# EAGLE schematic PoE_mag (EAGLE 6.4)

## Sheet 1 of 3
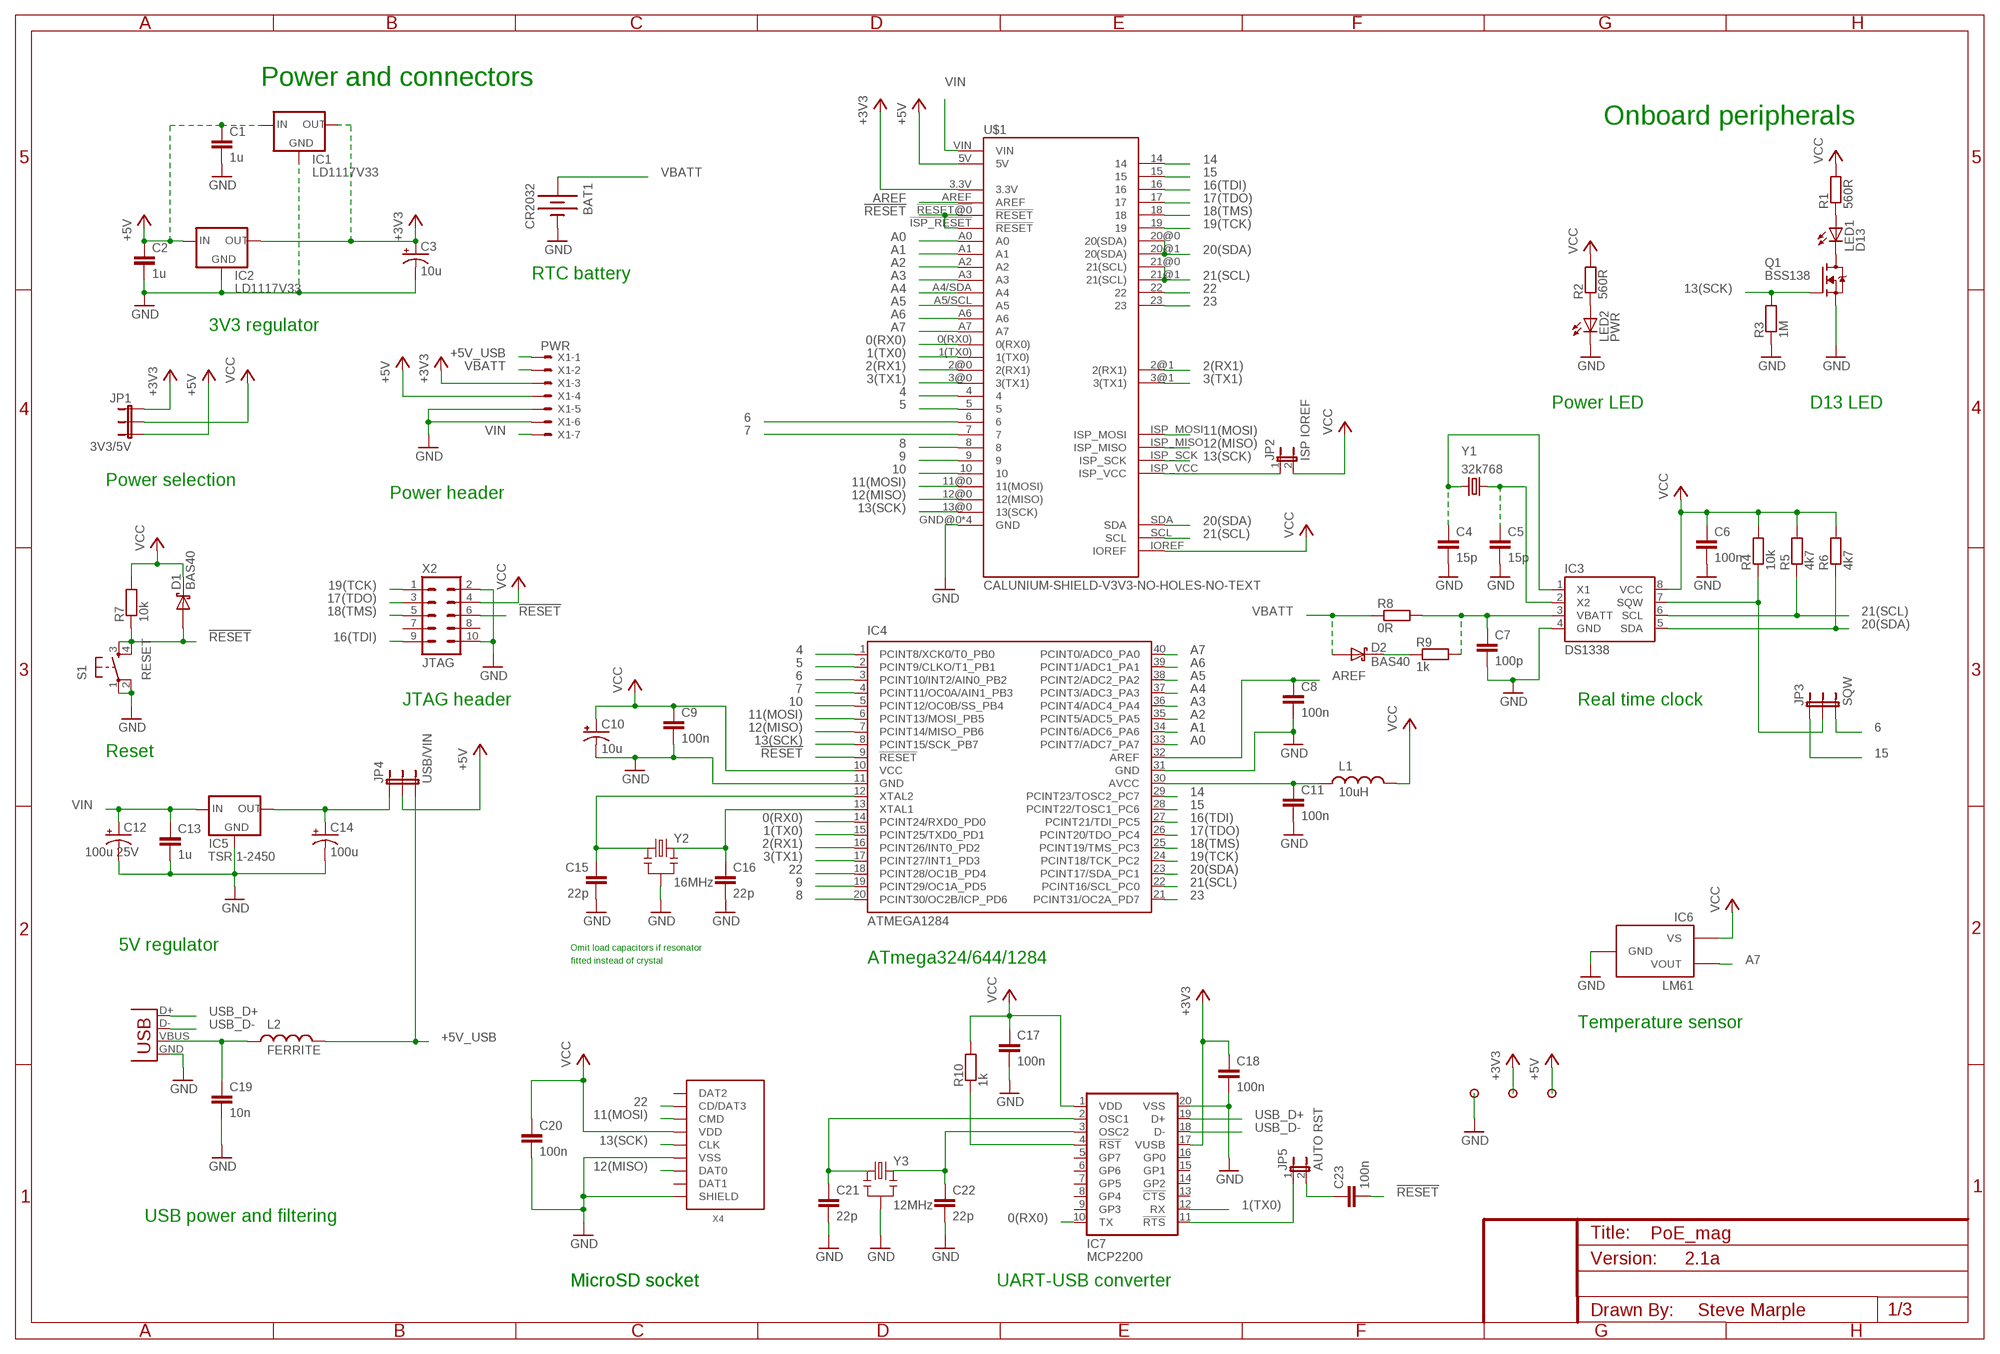
[diagram p0: schematic, sheet 1]

### Parts
BAT1  CR2032  BATTERY20PTH  [BATTCOM_20MM_PTH]
C1  1u  C-EU1206-HAND  [1206-HAND]
C2  1u  C-EU1206-HAND  [1206-HAND]
C3  10u  CAP_POLPTH2  [CPOL-RADIAL-10UF-25V]
C4  15p  C-EU0805-HAND  [0805-HAND]
C5  15p  C-EU0805-HAND  [0805-HAND]
C6  100n  C-EU1206-HAND  [1206-HAND]
C7  100p  C-EU1206-HAND  [1206-HAND]
C8  100n  C-EU1206-HAND  [1206-HAND]
C9  100n  C-EU1206-HAND  [1206-HAND]
C10  10u  CAP_POLPTH2  [CPOL-RADIAL-10UF-25V]
C11  100n  C-EU1206-HAND  [1206-HAND]
C12  100u 25V  CAP_POL  [CPOL-RADIAL-100UF-25V-150MIL]
C13  1u  C-EU1206-HAND  [1206-HAND]
C14  100u  CAP_POL100UF-16V-100MIL  [CPOL-RADIAL-100UF-16V]
C15  22p  C-EU0805-HAND  [0805-HAND]
C16  22p  C-EU0805-HAND  [0805-HAND]
C17  100n  C-EU1206-HAND  [1206-HAND]
C18  100n  C-EU1206-HAND  [1206-HAND]
C19  10n  C-EU1206-HAND  [1206-HAND]
C20  100n  C-EU1206-HAND  [1206-HAND]
C21  22p  C-EU0805-HAND  [0805-HAND]
C22  22p  C-EU0805-HAND  [0805-HAND]
C23  100n  C-EU1206-HAND  [1206-HAND]
D1  BAS40  DIODE-SCHOTTKYSOT23-1-3-HAND  [SOT23-3-HAND]
D2  BAS40  DIODE-SCHOTTKYSOT23-1-3-HAND  [SOT23-3-HAND]
IC1  LD1117V33  V_REG_LD1117VXXSOT223-HAND  [SOT223-HAND]
IC2  LD1117V33  V_REG_LD1117VXXTO220  [TO220]
IC3  DS1338  DS1307SO08  [SO08]
IC4  ATMEGA1284  ATMEGA644-20PU  [DIL40]
IC5  TSR 1-2450  V_REG_78XXTSR/POWERPAX  [TSR-1-XXXX/POWERPAX-P78XX-10]
IC6  LM61  LM61SOT23  [SOT23-3-HAND]
IC7  MCP2200  [SO20]
JP1  3V3/5V  JUMPER-3PTH  [1X03]
JP2  ISP IOREF  JUMPER-2PTH  [1X02]
JP3  SQW  JUMPER-3PTH  [1X03]
JP4  USB/VIN  JUMPER-3PTH  [1X03]
JP5  AUTO RST  JUMPER-2PTH  [1X02]
L1  10uH  INDUCTOR1210-HAND  [1210-HAND]
L2  FERRITE  INDUCTOR0805-HAND  [0805-HAND]
LED1  D13  LED3MM  [LED3MM]
LED2  PWR  LED3MM  [LED3MM]
Q1  BSS138  BSS138SOT23-3-HAND  [SOT23-3-HAND]
R1  560R  RESISTOR1206-HAND  [1206-HAND]
R2  560R  RESISTOR1206-HAND  [1206-HAND]
R3  1M  RESISTOR1206-HAND  [1206-HAND]
R4  10k  RESISTOR1206-HAND  [1206-HAND]
R5  4k7  RESISTOR1206-HAND  [1206-HAND]
R6  4k7  RESISTOR1206-HAND  [1206-HAND]
R7  10k  RESISTOR1206-HAND  [1206-HAND]
R8  0R  RESISTOR1206-HAND  [1206-HAND]
R9  1k  RESISTOR1206-HAND  [1206-HAND]
R10  1k  RESISTOR1206-HAND  [1206-HAND]
S1  RESET  TAC_SWITCHPTH  [TACTILE-PTH]
U$1  CALUNIUM-SHIELD-V3V3-NO-HOLES-NO-TEXT  [CALUNIUM-SHIELD-NO-OUTLINE-NO-HOLES-NO-TEXT-V3]
U$2  PAD  [PAD]
U$3  PAD  [PAD]
U$4  PAD  [PAD]
X1  PWR  22-23-2071  [22-23-2071]
X2  JTAG  ATMEL-JTAG  [CON-HARTING-ML10]
X3  USB  USBPTH-VERTICAL  [USB-B-PTH-VERTICAL]
X4  MICRO-SD-SOCKETHIROSE-DM3D  [MICRO-SD-SOCKET-HIROSE-DM3D]
Y1  32k768  CRYSTALTC38H  [TC38H]
Y2  16MHz  CRYSTAL-RESONATOR  [HC49U-V-RESONATOR]
Y3  12MHz  CRYSTAL-RESONATOR  [HC49U-V-RESONATOR]

### Nets
0(RX0): IC4.14(PCINT24/RXD0_PD0) IC7.10(TX) U$1.0(RX0)
1(TX0): IC4.15(PCINT25/TXD0_PD1) IC7.12(RX) U$1.1(TX0)
2(RX1): IC4.16(PCINT26/INT0_PD2) U$1.2@0(2(RX1)) U$1.2@1(2(RX1)) ; also sheet 2
3(TX1): IC4.17(PCINT27/INT1_PD3) U$1.3@0(3(TX1)) U$1.3@1(3(TX1)) ; also sheet 2
4: IC4.1(PCINT8/XCK0/T0_PB0) U$1.4
5: IC4.2(PCINT9/CLKO/T1_PB1) U$1.5
6: IC4.3(PCINT10/INT2/AIN0_PB2) JP3.3 U$1.6 ; also sheet 2
7: IC4.4(PCINT11/OC0A/AIN1_PB3) U$1.7 ; also sheet 2
8: IC4.20(PCINT30/OC2B/ICP_PD6) U$1.8 ; also sheet 3
9: IC4.19(PCINT29/OC1A_PD5) U$1.9
10: IC4.5(PCINT12/OC0B/SS_PB4) U$1.10
11(MOSI): IC4.6(PCINT13/MOSI_PB5) U$1.11@0(11(MOSI)) U$1.ISP_MOSI X4.CMD
12(MISO): IC4.7(PCINT14/MISO_PB6) U$1.12@0(12(MISO)) U$1.ISP_MISO X4.DAT0
13(SCK): IC4.8(PCINT15/SCK_PB7) Q1.1(G) R3.2 U$1.13@0(13(SCK)) U$1.ISP_SCK X4.CLK
14: IC4.29(PCINT23/TOSC2_PC7) U$1.14
15: IC4.28(PCINT22/TOSC1_PC6) JP3.1 U$1.15
16(TDI): IC4.27(PCINT21/TDI_PC5) U$1.16 X2.9(TDI)
17(TDO): IC4.26(PCINT20/TDO_PC4) U$1.17 X2.3(TDO)
18(TMS): IC4.25(PCINT19/TMS_PC3) U$1.18 X2.5(TMS)
19(TCK): IC4.24(PCINT18/TCK_PC2) U$1.19 X2.1(TCK)
20(SDA): IC3.5(SDA) IC4.23(PCINT17/SDA_PC1) R6.1 U$1.20@0(20(SDA)) U$1.20@1(20(SDA)) U$1.SDA ; also sheet 3
21(SCL): IC3.6(SCL) IC4.22(PCINT16/SCL_PC0) R5.1 U$1.21@0(21(SCL)) U$1.21@1(21(SCL)) U$1.SCL ; also sheet 3
22: IC4.18(PCINT28/OC1B_PD4) U$1.22 X4.CD/DAT3
23: IC4.21(PCINT31/OC2A_PD7) U$1.23
!MCP2200_RESET: IC7.4(!RST) R10.1
!RESET: C23.2 D1.1(A) IC4.9(!RESET) R7.1 S1.3 S1.4 U$1.!ISP_RESET(!RESET) U$1.!RESET@0(!RESET) X2.6(!SRST)
+3V3 [power]: C3.1(+) C18.1 IC1.2(OUT) IC1.4(OUT) IC2.2(OUT) IC7.17(VUSB) JP1.1 U$1.3.3V U$3.1 X1.3 ; also sheet 2,3
+5V [power]: C1.1 C2.1 IC1.3(IN) IC2.3(IN) JP1.3 JP4.2 U$1.5V U$4.1 X1.4 ; also sheet 2,3
+5V_USB [power]: JP4.3 L2.2 X1.1
A0: IC4.33(PCINT7/ADC7_PA7) U$1.A0 ; also sheet 2
A1: IC4.34(PCINT6/ADC6_PA6) U$1.A1
A2: IC4.35(PCINT5/ADC5_PA5) U$1.A2 ; also sheet 3
A3: IC4.36(PCINT4/ADC4_PA4) U$1.A3
A4: IC4.37(PCINT3/ADC3_PA3) U$1.A4/SDA(A4)
A5: IC4.38(PCINT2/ADC2_PA2) U$1.A5/SCL(A5)
A6: IC4.39(PCINT1/ADC1_PA1) U$1.A6
A7: IC4.40(PCINT0/ADC0_PA0) IC6.2(VOUT) U$1.A7
AREF: C8.1 IC4.32(AREF) U$1.AREF
AUTO_RESET: IC7.11(!RTS) JP5.1
AVCC [power]: C11.1 IC4.30(AVCC) L1.1
GND [power]: BAT1.2(-) C1.2 C2.2 C3.2(-) C4.2 C5.2 C6.2 C7.2 C8.2 C9.2 C10.2(-) C11.2 C12.2(-) C13.2 C14.2(-) C15.2 C16.2 C17.2 C18.2 C19.2 C20.2 C21.2 C22.2 IC1.1(GND) IC2.1(GND) IC3.4(GND) IC4.11(GND) IC4.31(GND) IC5.2@A(GND) IC5.2@B(GND) IC6.3(GND) IC7.20(VSS) LED2.K(C) Q1.2(S) R3.1 S1.1 S1.2 U$1.GND@0(GND) U$1.GND@1(GND) U$1.GND@2(GND) U$1.GND@3(GND) U$2.1 X1.5 X1.6 X2.2(GND) X2.10(GND) X3.GND X4.GND(VSS) X4.SHIELD@0(SHIELD) Y2.GND Y3.GND ; also sheet 2,3
N$1: C16.1 IC4.13(XTAL1) Y2.2
N$2: C15.1 IC4.12(XTAL2) Y2.1
N$3: LED1.A R1.1
N$4: LED1.K(C) Q1.3(D)
N$5: C4.1 IC3.1(X1) Y1.2
N$6 [power]: JP2.1 U$1.ISP_VCC
N$7: C22.1 IC7.3(OSC2) Y3.2
N$8: LED2.A R2.1
N$9: D2.3(C) R9.1
N$11: C7.1 IC3.3(VBATT) R8.2 R9.2
N$12: C5.1 IC3.2(X2) Y1.1
N$14 [power]: C14.1(+) IC5.3@A(OUT) IC5.3@B(OUT) JP4.1
N$15: C23.1 JP5.2
N$18: C21.1 IC7.2(OSC1) Y3.1
SQW: IC3.7(SQW) JP3.2 R4.1
USB_D+: IC7.19(D+) X3.D+
USB_D-: IC7.18(D-) X3.D-
VBATT: BAT1.1(+) D2.1(A) R8.1 X1.2 ; also sheet 2
VBUS [power]: C19.1 L2.1 X3.VBUS
VCC [power]: C6.1 C9.1 C10.1(+) C17.1 C20.1 D1.3(C) IC3.8(VCC) IC4.10(VCC) IC6.1(VS) IC7.1(VDD) JP1.2 JP2.2 L1.2 R1.2 R2.2 R4.2 R5.2 R6.2 R7.2 R10.2 U$1.IOREF X2.4(VTREF) X4.VDD ; also sheet 2,3
VIN [power]: C12.1(+) C13.1 IC5.1@A(IN) IC5.1@B(IN) U$1.VIN X1.7 ; also sheet 3
Unconnected: IC7.5(GP7) IC7.6(GP6) IC7.7(GP5) IC7.8(GP4) IC7.9(GP3) IC7.13(!CTS) IC7.14(GP2) IC7.15(GP1) IC7.16(GP0) X2.7(NC) X2.8(NC) X4.DAT1 X4.DAT2

### Notes on the sheet
- Power and connectors
- Onboard peripherals
- RTC battery
- 3V3 regulator
- Power LED | D13 LED
- Power selection
- Power header
- JTAG header | Real time clock
- Reset
- 5V regulator | Omit load capacitors if resonator
- fitted instead of crystal | ATmega324/644/1284
- Temperature sensor
- USB power and filtering
- 2.1a
- MicroSD socket | MicroSD socket | UART-USB converter
- Steve Marple

## Sheet 2 of 3
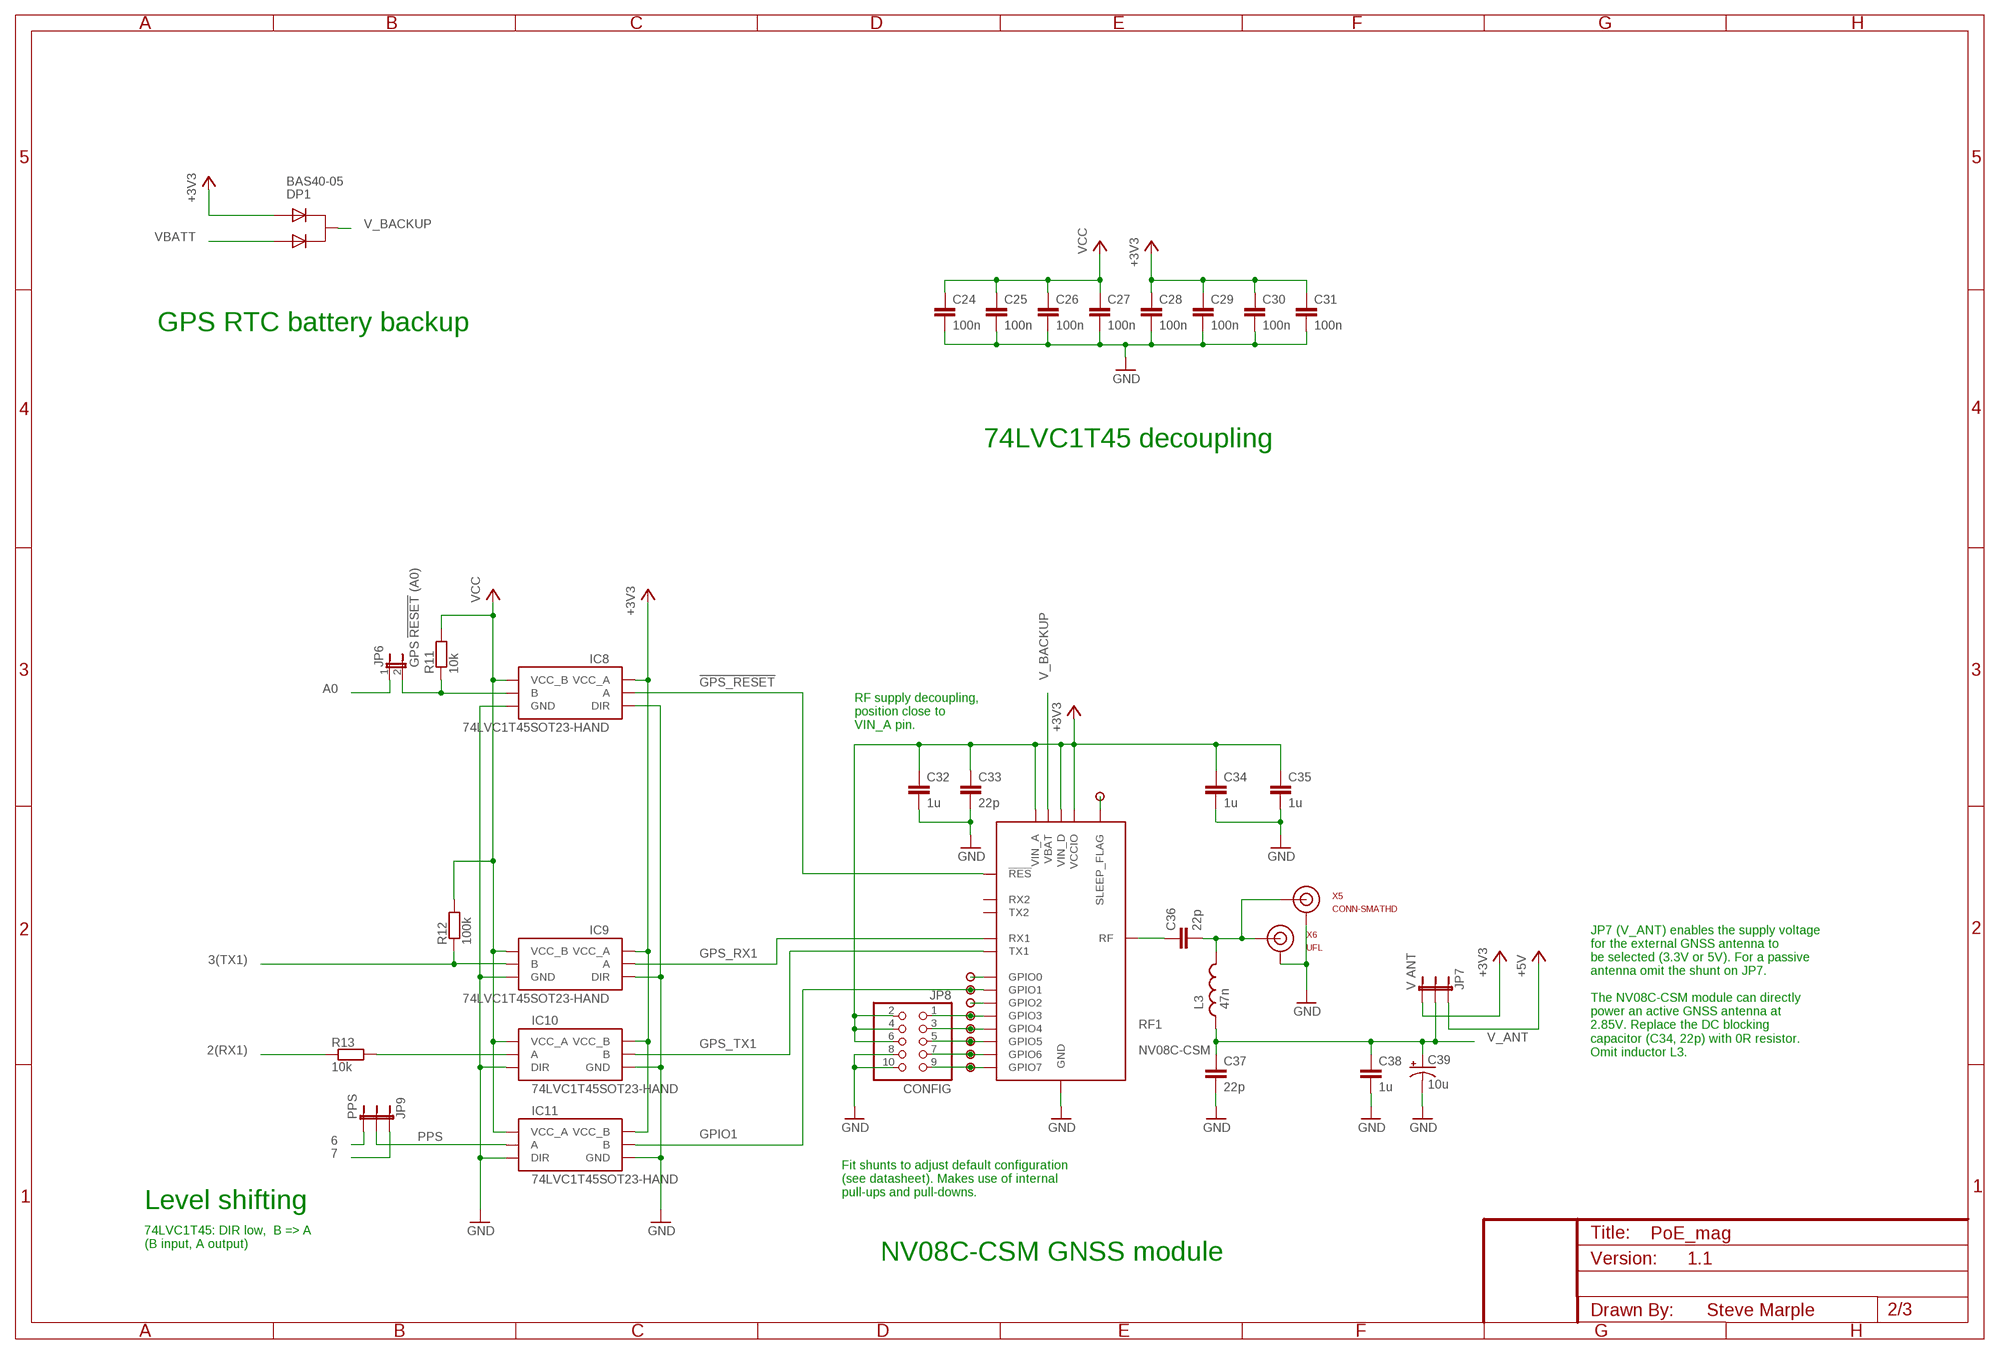
[diagram p1: schematic, sheet 2]

### Parts
C24  100n  C-EU1206-HAND  [1206-HAND]
C25  100n  C-EU1206-HAND  [1206-HAND]
C26  100n  C-EU1206-HAND  [1206-HAND]
C27  100n  C-EU1206-HAND  [1206-HAND]
C28  100n  C-EU1206-HAND  [1206-HAND]
C29  100n  C-EU1206-HAND  [1206-HAND]
C30  100n  C-EU1206-HAND  [1206-HAND]
C31  100n  C-EU1206-HAND  [1206-HAND]
C32  1u  C-EU1206-HAND  [1206-HAND]
C33  22p  C-EU0805-HAND  [0805-HAND]
C34  1u  C-EU1206-HAND  [1206-HAND]
C35  1u  C-EU1206-HAND  [1206-HAND]
C36  22p  C-EU0805-HAND  [0805-HAND]
C37  22p  C-EU0805-HAND  [0805-HAND]
C38  1u  C-EU1206-HAND  [1206-HAND]
C39  10u  CAP_POLPTH2  [CPOL-RADIAL-10UF-25V]
DP1  BAS40-05  DIODE-PAIR-COMMON-CATHODE  [SOT23-3-HAND]
IC8  74LVC1T45SOT23-HAND  [SOT23-6-HAND]
IC9  74LVC1T45SOT23-HAND  [SOT23-6-HAND]
IC10  74LVC1T45SOT23-HAND  [SOT23-6-HAND]
IC11  74LVC1T45SOT23-HAND  [SOT23-6-HAND]
JP6  GPS !RESET! (A0)  JUMPER-2PTH  [1X02]
JP7  V ANT  JUMPER-3PTH  [1X03]
JP8  CONFIG  PINHD-2X5  [2X05]
JP9  PPS  JUMPER-3PTH  [1X03]
L3  47n  INDUCTOR0805-HAND  [0805-HAND]
R11  10k  RESISTOR1206-HAND  [1206-HAND]
R12  100k  RESISTOR1206-HAND  [1206-HAND]
R13  10k  RESISTOR1206-HAND  [1206-HAND]
RF1  NV08C-CSM  NV08C-CSMHAND  [NVC08C-CSM-HAND]
U$5  PAD  [PAD]
U$6  PAD  [PAD]
U$7  PAD  [PAD]
U$8  ?  PAD  [PAD]
U$9  PAD  [PAD]
U$10  PAD  [PAD]
U$11  PAD  [PAD]
U$12  PAD  [PAD]
U$13  PAD  [PAD]
X5  CONN-SMATHD  [SMA-THD]
X6  UFL  CONN-UFLHAND  [CONN-UFL-HAND-SOLDERING]

### Nets
2(RX1): R13.1 ; also sheet 1
3(TX1): IC9.4(B) R12.1 ; also sheet 1
6: JP9.3 ; also sheet 1
7: JP9.1 ; also sheet 1
!GPS_RESET: IC8.3(A) RF1.P$25(!RES)
+3V3 [power]: C28.1 C29.1 C30.1 C31.1 C32.1 C33.1 C34.1 C35.1 DP1.2(A2) IC8.1(VCC_A) IC9.1(VCC_A) IC10.6(VCC_B) IC11.6(VCC_B) JP7.3 JP8.2 JP8.4 JP8.6 RF1.P$8(VIN_A) RF1.P$26(VIN_D) RF1.P$28(VCCIO) ; also sheet 1,3
+5V [power]: JP7.1 ; also sheet 1,3
A0: JP6.1 ; also sheet 1
GND [power]: C24.2 C25.2 C26.2 C27.2 C28.2 C29.2 C30.2 C31.2 C32.2 C33.2 C34.2 C35.2 C37.2 C38.2 C39.2(-) IC8.2(GND) IC8.5(DIR) IC9.2(GND) IC9.5(DIR) IC10.2(GND) IC10.5(DIR) IC11.2(GND) IC11.5(DIR) JP8.8 JP8.10 RF1.P$3(GND) RF1.P$9(GND) RF1.P$10(GND) RF1.P$11(GND) RF1.P$12(GND) RF1.P$13(GND) RF1.P$14(GND) RF1.P$16(GND) RF1.P$17(GND) RF1.P$18(GND) RF1.P$19(GND) RF1.P$22(GND) RF1.P$24(GND) RF1.P$27(GND) RF1.P$29(GND) RF1.P$34(GND) X5.GND@0(GND) X5.GND@1(GND) X5.GND@2(GND) X5.GND@3(GND) X6.GND@0(GND) X6.GND@1(GND) ; also sheet 1,3
GPIO0: RF1.P$20(GPIO0) U$6.1
GPIO1: IC11.4(B) RF1.P$2(GPIO1) U$7.1
GPIO2: RF1.P$1(GPIO2) U$8.1
GPIO3: JP8.1 RF1.P$6(GPIO3) U$9.1
GPIO4: JP8.3 RF1.P$7(GPIO4) U$10.1
GPIO5: JP8.5 RF1.P$4(GPIO5) U$11.1
GPIO6: JP8.7 RF1.P$35(GPIO6) U$12.1
GPIO7: JP8.9 RF1.P$5(GPIO7) U$13.1
GPS_RX1: IC9.3(A) RF1.P$33(RX1)
GPS_TX1: IC10.4(B) RF1.P$32(TX1)
N$22: IC8.4(B) JP6.2 R11.1
N$23 [antenna]: C36.2 L3.2 X5.SIG(SIGNAL) X6.SIGNAL
N$24 [antenna]: C36.1 RF1.P$15(RF)
N$25: IC10.3(A) R13.2
PPS: IC11.3(A) JP9.2
SLEEP_FLAG: RF1.P$21(SLEEP_FLAG) U$5.1
V_ANT [power]: C37.1 C38.1 C39.1(+) JP7.2 L3.1
V_BACKUP: DP1.3(C) RF1.P$23(VBAT)
VBATT: DP1.1(A1) ; also sheet 1
VCC [power]: C24.1 C25.1 C26.1 C27.1 IC8.6(VCC_B) IC9.6(VCC_B) IC10.1(VCC_A) IC11.1(VCC_A) R11.2 R12.2 ; also sheet 1,3
Unconnected: RF1.P$30(RX2) RF1.P$31(TX2)

### Notes on the sheet
- GPS RTC battery backup
- 74LVC1T45 decoupling
- RF supply decoupling,
  position close to
  VIN_A pin.
- JP7 (V_ANT) enables the supply voltage
  for the external GNSS antenna to
  be selected (3.3V or 5V). For a passive
  antenna omit the shunt on JP7.
  
  The NV08C-CSM module can directly
  power an active GNSS antenna at
  2.85V. Replace the DC blocking
  capacitor (C34, 22p) with 0R resistor.
  Omit inductor L3.
- Fit shunts to adjust default configuration
  (see datasheet). Makes use of internal
  pull-ups and pull-downs.
- Level shifting
- 74LVC1T45: DIR low,  B => A
  (B input, A output)
- NV08C-CSM GNSS module | 1.1
- Steve Marple

## Sheet 3 of 3
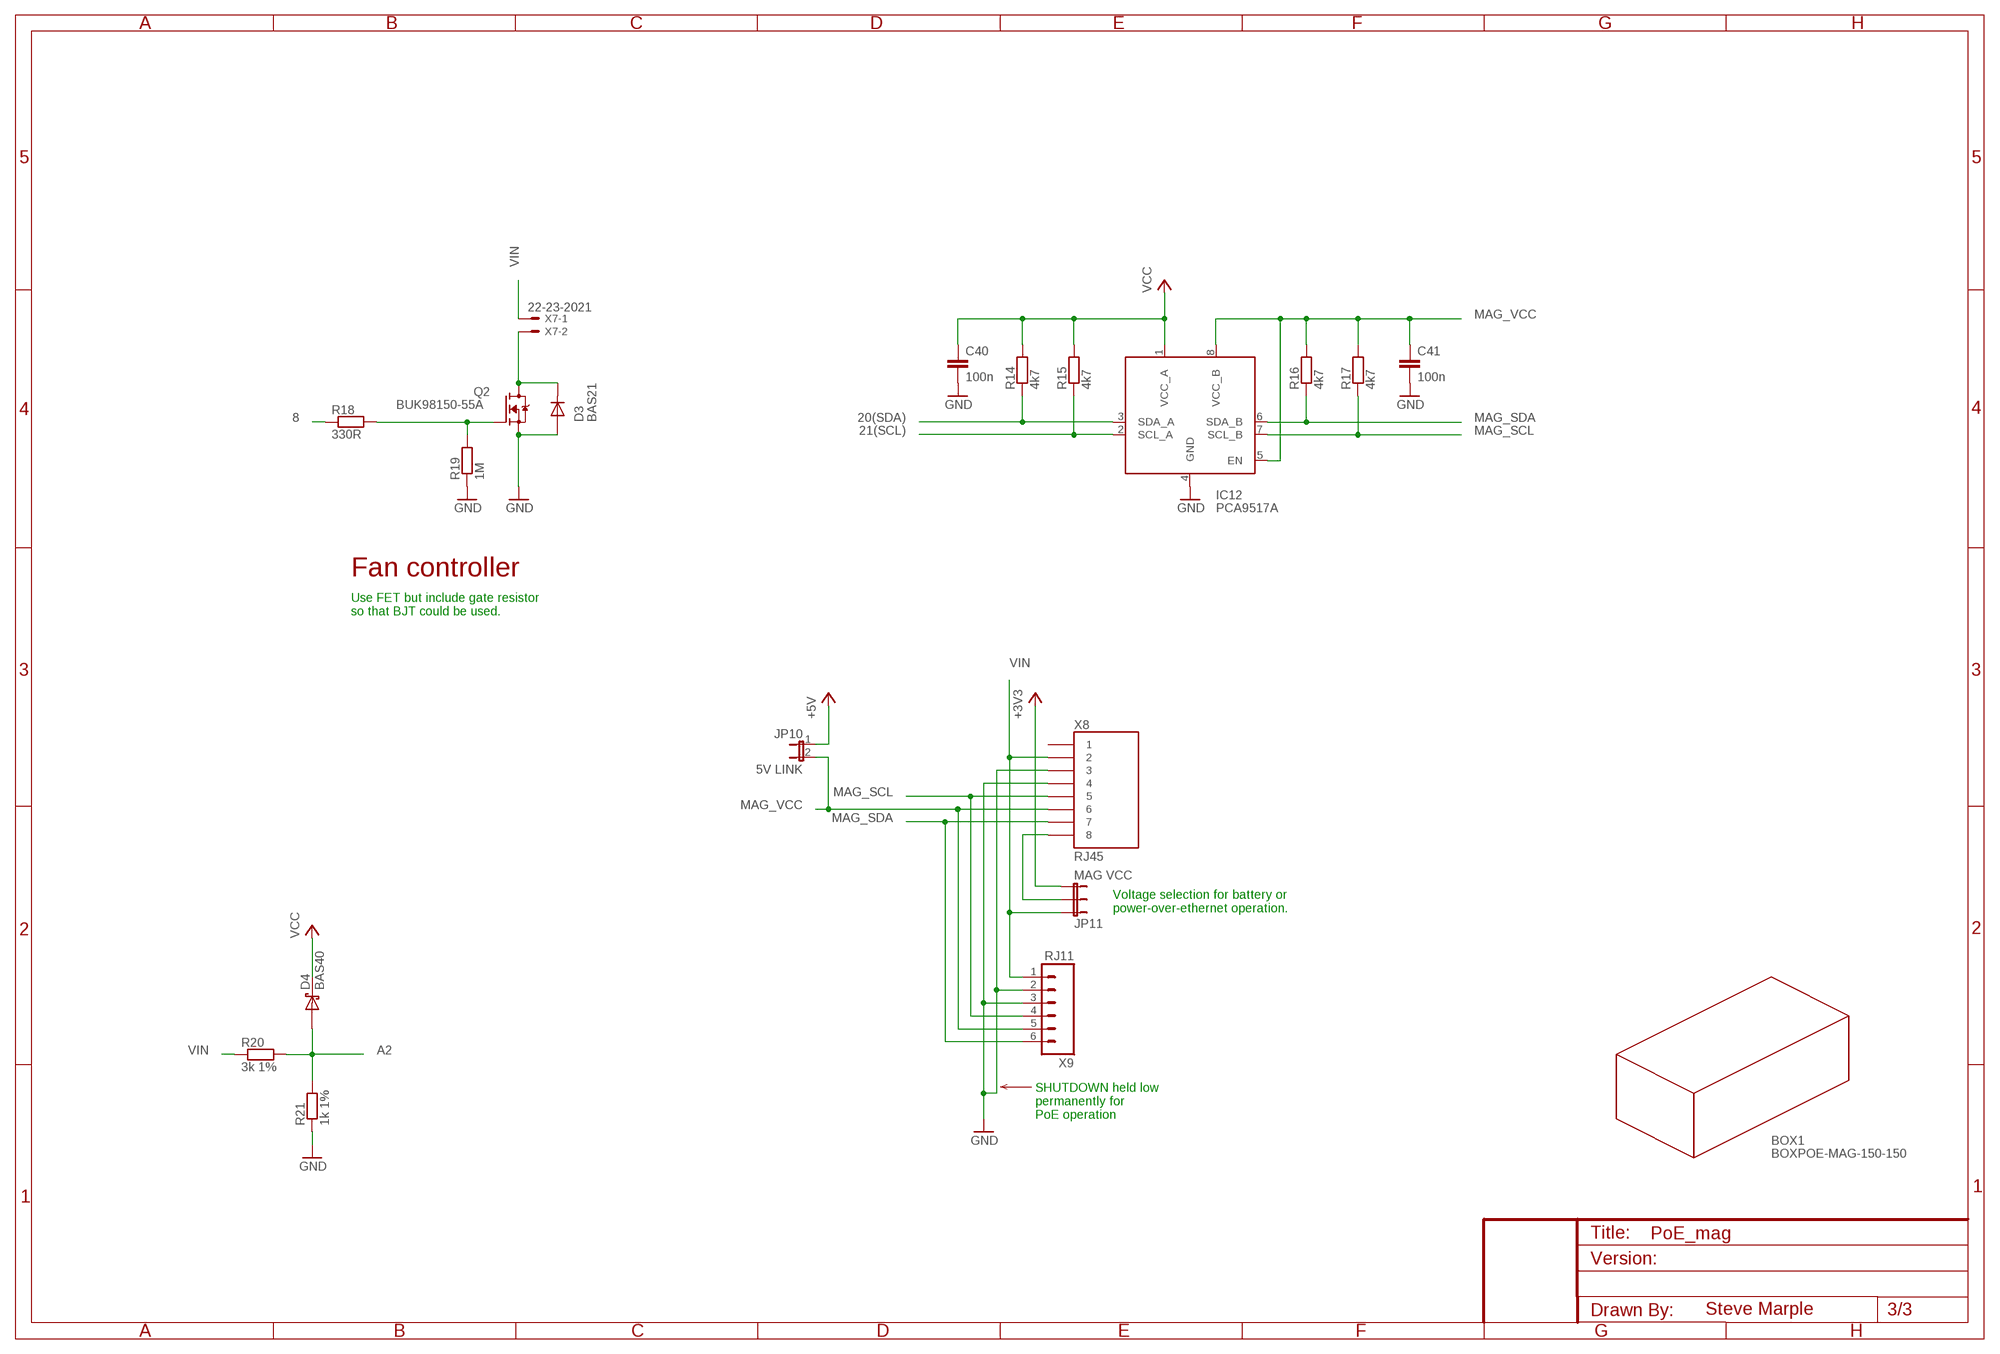
[diagram p2: schematic, sheet 3]

### Parts
BOX1  BOXPOE-MAG-150-150  [FIBOX-PC-M-95-G-POE-MAG]
C40  100n  C-EU1206-HAND  [1206-HAND]
C41  100n  C-EU1206-HAND  [1206-HAND]
D3  BAS21  DIODESOT23-1-3-HAND  [SOT23-3-HAND]
D4  BAS40  DIODE-SCHOTTKYSOT23-1-3-HAND  [SOT23-3-HAND]
IC12  PCA9517A  PCA9517ASOIC  [SO08]
JP10  5V LINK  JUMPER-2PTH  [1X02]
JP11  MAG VCC  JUMPER-3PTH  [1X03]
Q2  BUK98150-55A  FET-N-TYPESOT223-HAND  [SOT223-HAND]
R14  4k7  RESISTOR1206-HAND  [1206-HAND]
R15  4k7  RESISTOR1206-HAND  [1206-HAND]
R16  4k7  RESISTOR1206-HAND  [1206-HAND]
R17  4k7  RESISTOR1206-HAND  [1206-HAND]
R18  330R  RESISTOR1206-HAND  [1206-HAND]
R19  1M  RESISTOR1206-HAND  [1206-HAND]
R20  3k 1%  RESISTOR1206-HAND  [1206-HAND]
R21  1k 1%  RESISTOR1206-HAND  [1206-HAND]
X7  22-23-2021  [22-23-2021]
X8  RJ45  RJ45-8PTH  [RJ45-8]
X9  RJ11  RJ11-6PTH  [RJ11-6]

### Nets
8: R18.1 ; also sheet 1
20(SDA): IC12.3(SDA_A) R14.1 ; also sheet 1
21(SCL): IC12.2(SCL_A) R15.1 ; also sheet 1
+3V3 [power]: JP11.3 ; also sheet 1,2
+5V [power]: JP10.1 ; also sheet 1,2
A2: D4.1(A) R20.2 R21.2 ; also sheet 1
FAN_CTRL: D3.3(C) Q2.2(D) Q2.4(D) X7.2
GND [power]: C40.2 C41.2 D3.1(A) IC12.4(GND) Q2.3(S) R19.1 R21.1 X8.3 X8.4 X9.2 X9.3 ; also sheet 1,2
MAG_SCL: IC12.7(SCL_B) R17.1 X8.5 X9.4
MAG_SDA: IC12.6(SDA_B) R16.1 X8.7 X9.6
MAG_VCC [power]: C41.1 IC12.5(EN) IC12.8(VCC_B) JP10.2 R16.2 R17.2 X8.6 X9.5
N$26 [power]: JP11.2 X8.8
N$29: Q2.1(G) R18.2 R19.2
VCC [power]: C40.1 D4.3(C) IC12.1(VCC_A) R14.2 R15.2 ; also sheet 1,2
VIN [power]: JP11.1 R20.1 X7.1 X8.2 X9.1 ; also sheet 1
Unconnected: X8.1

### Notes on the sheet
- Fan controller
- Use FET but include gate resistor
  so that BJT could be used.
- Voltage selection for battery or
  power-over-ethernet operation.
- SHUTDOWN held low
  permanently for 
  PoE operation
- Steve Marple

## Library data of the parts
BAT1 = SteveMarple:BATTERY: Battery Holders Various common sizes : AA, AAA, 20mm coin cell and 12mm coin cell.
BOX1 = fibox:BOX
C1 C2 C4-C9 C11 C13 C17-C38 C40 C41 = SteveMarple:C-EU
C3 C10 C12 C14 C39 = SteveMarple:CAP_POL: Capacitor Polarized These are standard SMD and PTH capacitors. Normally 10uF, 47uF, and 100uF in electrolytic and tantalum varieties. Always verify the external diameter of the through hole cap, it varies with capacity, voltage, and manufacturer. The EIA devices should be standard.
C15 C16 = SteveMarple:C-EU; OPTION: Do not fit for ceramic resonator
D1 D2 D4 = SteveMarple:DIODE-SCHOTTKY
D3 = SteveMarple:DIODE
DP1 = SteveMarple:DIODE-PAIR-COMMON-CATHODE
IC1 IC2 = SteveMarple:V_REG_LD1117VXX: LD1117VXX voltage regulator CHECK PINOUT!!!!!!!!!!!!!!!!!!!
IC3 = SteveMarple:DS1307
IC4 = SteveMarple:ATMEGA644-*PU: 8-bit Microcontroller with 64K Bytes In-System Programmable Flash Auto generated by make-symbol-device-package-bsdl.ulp Rev. 34 Source: http://www.atmel.com/dyn/resources/prod_documents/doc2593.pdf; MPN: ATMEGA644-20PU; OC_FARNELL: 1288340; OC_NEWARK: 23M5060
IC5 = PoE_lib:V_REG_78XX: Voltage Regulator Standard 7805 5V regulator. IGO (Input Ground Output). Spark Fun Electronics SKU : COM-00107
IC6 = SteveMarple:LM61
IC7 = SteveMarple:MCP2200: MCP2200 Microchip USB-UART interface.
IC8-IC11 = SteveMarple:74LVC1T45
IC12 = SteveMarple:PCA9517A
JP1 JP3 JP4 JP7 JP9 JP11 = SparkFun:JUMPER-3
JP2 JP5 JP6 JP10 = SparkFun:JUMPER-2: Jumper Basic 0.1" spaced jumper. Use with breakaway headers.
JP8 = pinhead:PINHD-2X5: PIN HEADER
L1-L3 = SteveMarple:INDUCTOR: Inductors Basic Inductor/Choke - 0603 and 1206. Footprints are not proven and vary greatly between part numbers.
LED1 LED2 = PoE_lib:LED: LEDs Standard schematic elements and footprints for 5mm, 3mm, 1206, and 0603 sized LEDs. 5mm - Spark Fun Electronics SKU : COM-00529 (and others)
Q1 = SteveMarple:BSS138: BSS138 FET
Q2 = SteveMarple:FET-N-TYPE
R1-R21 = SteveMarple:RESISTOR: 1/4W PTH resistor
RF1 = nvs-tech:NV08C-CSM
S1 = SparkFun:TAC_SWITCH: Momentary Switch Button commonly used for reset or general input. Spark Fun Electronics SKU : COM-00097
U$1 = SteveMarple:CALUNIUM-SHIELD-V3
U$2-U$13 = SteveMarple:PAD
X1 = PoE_lib:22-23-2071: .100" (2.54mm) Center Header - 7 Pin; MF: MOLEX; MPN: 22-23-2071; OC_FARNELL: 1654534; OC_NEWARK: 56H0445
X2 = SteveMarple:ATMEL-JTAG: ATMEL JTAG header
X3 = SteveMarple:USB: USB Connectors USB-B-PTH is fully proven SKU : PRT-00139 USB-miniB is fully proven SKU : PRT-00587 USB-A-PCB is untested. USB-A-H is throughly reviewed, but untested. Spark Fun Electronics SKU : PRT-00437 USB-B-SMT is throughly reviewed, but untested. Needs silkscreen touching up. USB-A-S has not been used/tested USB-MB-H has not been used/tested
X4 = SteveMarple:MICRO-SD-SOCKET
X5 = SteveMarple:CONN-SMA: SMA connector
X6 = SteveMarple:CONN-UFL
X7 = PoE_lib:22-23-2021: .100" (2.54mm) Center Header - 2 Pin; MF: MOLEX; MPN: 22-23-2021; OC_FARNELL: 1462926; OC_NEWARK: 25C3832
X8 = SteveMarple:RJ45-8: RJ45 Jack Simple RJ45, 8-pin connection - connector for common Cat5, Cat5e, and Cat6 Ethernet cables. Footprint not yet proven in production. Connector sku is PRT-00643; Breakout PCB sku is BOB-00716.
X9 = SteveMarple:RJ11-6: RJ11 Jack Simple 6 pin RJ11 jack. Commonly found on CAT3 devices and Microchip programmers. SKU: PRT-00132
Y1 = SteveMarple:CRYSTAL: Crystals Various standard crystals. Proven footprints. Spark Fun Electronics SKU : COM-00534
Y2 Y3 = SteveMarple:CRYSTAL-RESONATOR: Crystal/resonator; OPTION: Crystal or ceramic resonator. Max 12MHz for 3V3 operation.

## Net classes
1 power: width 0.381 mm
2 antenna: width 0.66 mm